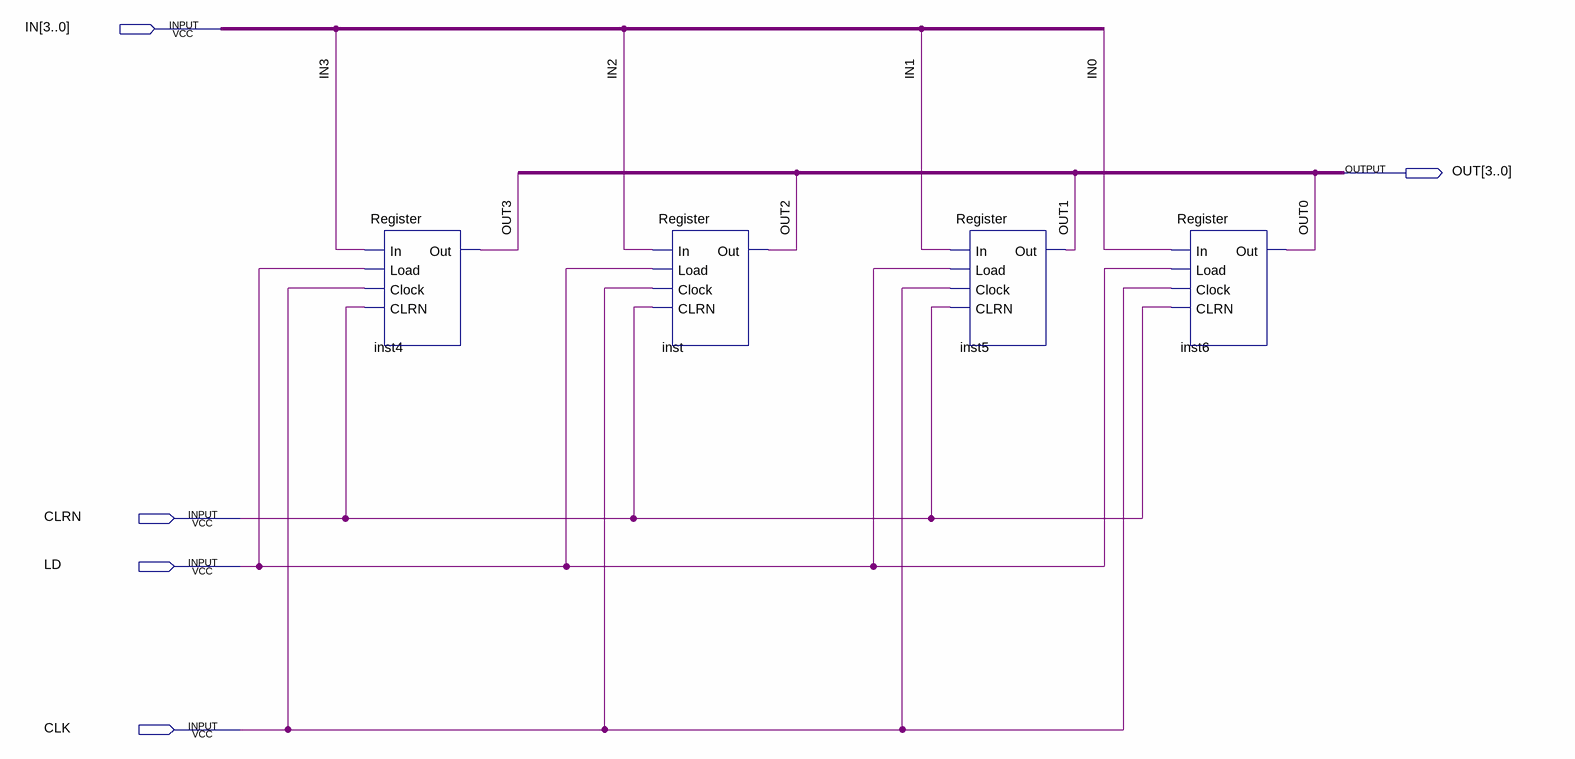
[diagram p0: schematic sheet]
// Quartus schematic reg4b.bdf as structural Verilog: 4 symbols, 5 pins
module reg4b (
  input  [3:0] IN,
  input  CLRN,
  input  LD,
  input  CLK,
  output [3:0] OUT
);

  Register inst4 (.In(IN[3]), .Load(LD), .Clock(CLK), .CLRN(CLRN), .Out(OUT[3]));
  Register inst (.In(IN[2]), .Load(LD), .Clock(CLK), .CLRN(CLRN), .Out(OUT[2]));
  Register inst5 (.In(IN[1]), .Load(LD), .Clock(CLK), .CLRN(CLRN), .Out(OUT[1]));
  Register inst6 (.In(IN[0]), .Load(LD), .Clock(CLK), .CLRN(CLRN), .Out(OUT[0]));
endmodule
